# Altium schematic sheet AS5600.SchDoc
size A4; Revision: 10
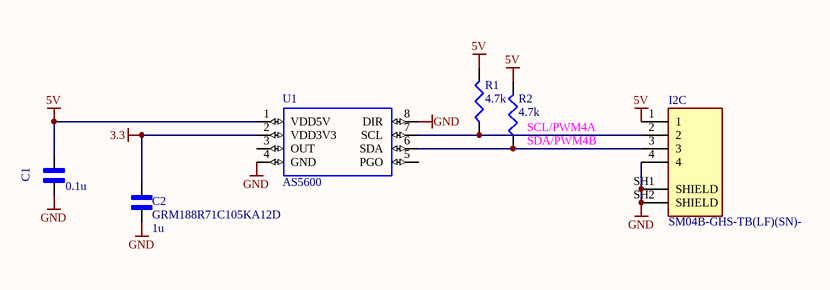
[diagram p0: AS5600.SchDoc]

## Parts
C1  value 0.1u  [*CAPC1608X90]  (hidden comment: GX035C104MAT2-500)
C2  GRM188R71C105KA12D  value 1u  [CAPC1608X90N]
I2C  SM04B-GHS-TB(LF)(SN)-  [JST_SM04B-GHS-TB(LF)(SN)-]
R1  value 4.7k  [J1-0603]  (hidden comment: RC0603FR-074K7L)
R2  value 4.7k  [J1-0603]  (hidden comment: RC0603FR-074K7L)
U1  AS5600  [SOIC127P600X175-8N]

## Nets
3.3: C2.2 U1.2(VDD3V3)
5V: C1.1 I2C.1 R1.2 R2.2 U1.1(VDD5V)
GND: C1.2 C2.1 I2C.4 I2C.SH1(SHIELD) I2C.SH2(SHIELD) U1.4(GND) U1.8(DIR)
SCL/PWM4A: I2C.2 R1.1 U1.7(SCL)
SDA/PWM4B: I2C.3 R2.1 U1.6(SDA)

Not connected (* = marked no-connect by the designer): U1 3(OUT) 5(PGO)

## Library data of the parts
C1 = GX035C104MAT2-500: Cap Thin Film 0.1uf 50v 0603; MF: AVX; Type: SMD; Package: 0603 AVX; MP: GX035C104MAT2-500; SnapEDA_Link: https://www.snapeda.com/parts/GX035C104MAT2-500/AVX/view-part/?ref=snap; ChipDip_Link: https://www.chipdip.ru/product0/9000410929
C2 = GRM188R71C105KA12D: SMD Capacitor X7R(EIA) with Capacitance: 1.0uF Tol. 10%. Rated Voltage: 16Vdc; MF: Murata Electronics; MP: GRM188R71C105KA12D; SnapEDA_Link: https://www.snapeda.com/parts/GRM188R71C105KA12D/Murata%20Electronics%20North%20America/view-part/228340/?ref=snap; Package: 0603; ChipDip_Link: https://www.chipdip.ru/product/grm188r71c105ka12d; HelpURL: https://static.chipdip.ru/lib/428/DOC005428493.pdf; Type: SMD
I2C = SM04B-GHS-TB(LF)(SN)-: Connector Header Surface Mount, Right Angle 4 position 0.049 _1.25mm_; MF: JST Sales; Instructions: DNP; MP: SM04B-GHS-TB(LF)(SN); Package: None; Value: *; SnapEDA_Link: https://www.snapeda.com/parts/SM04B-GHS-TB%28LF%29%28SN%29-/JST%20Sales%20America%20Inc./view-part/2759740/?ref=snap; HelpURL: http://www.farnell.com/datasheets/2082975.pdf; System: Connector; ChipDip_Link: https://www.chipdip.ru/product/sm04b-ghs-tb-lf-sn-gh-1.25mm-header-side-ent
R1 R2 = RC0603FR-074K7L: 4.7 kOhms ±1% 0.1W, 1/10W Chip Resistor 0603 (1608 Metric) Thick Film; MF: Yageo or NXP; ChipDip_Link: https://www.chipdip.ru/product0/9000079736; HelpURL: https://www.yageo.com/upload/media/product/productsearch/datasheet/rchip/PYu-RC_Group_51_RoHS_L_10.pdf; Package: R0603; Type: SMD; MP: RC0603FR-074K7L; SnapEDA_Link: https://www.snapeda.com/parts/RC0603FR-074K7L/Yageo/view-part/?ref=dk&t=RC0603FR-074K7L&con_ref=None
U1 = AS5600: Hall Effect Sensor Angle External Magnet, Not Included Gull Wing; MF: ams; Package: SOIC-8 ams; MP: AS5600; Availability: In Stock; SnapEDA_Link: https://www.snapeda.com/parts/AS5600-ASOT/ams/view-part/?ref=snap; Price: None; Check_prices: https://www.snapeda.com/parts/AS5600-ASOT/ams/view-part/?ref=eda; Value: *; Purchase-URL: https://pricing.snapeda.com/search/part/AS5600-ASOT/?ref=eda